# EAGLE design Arduino-DUE-SHEILD (EAGLE 8.0.0)
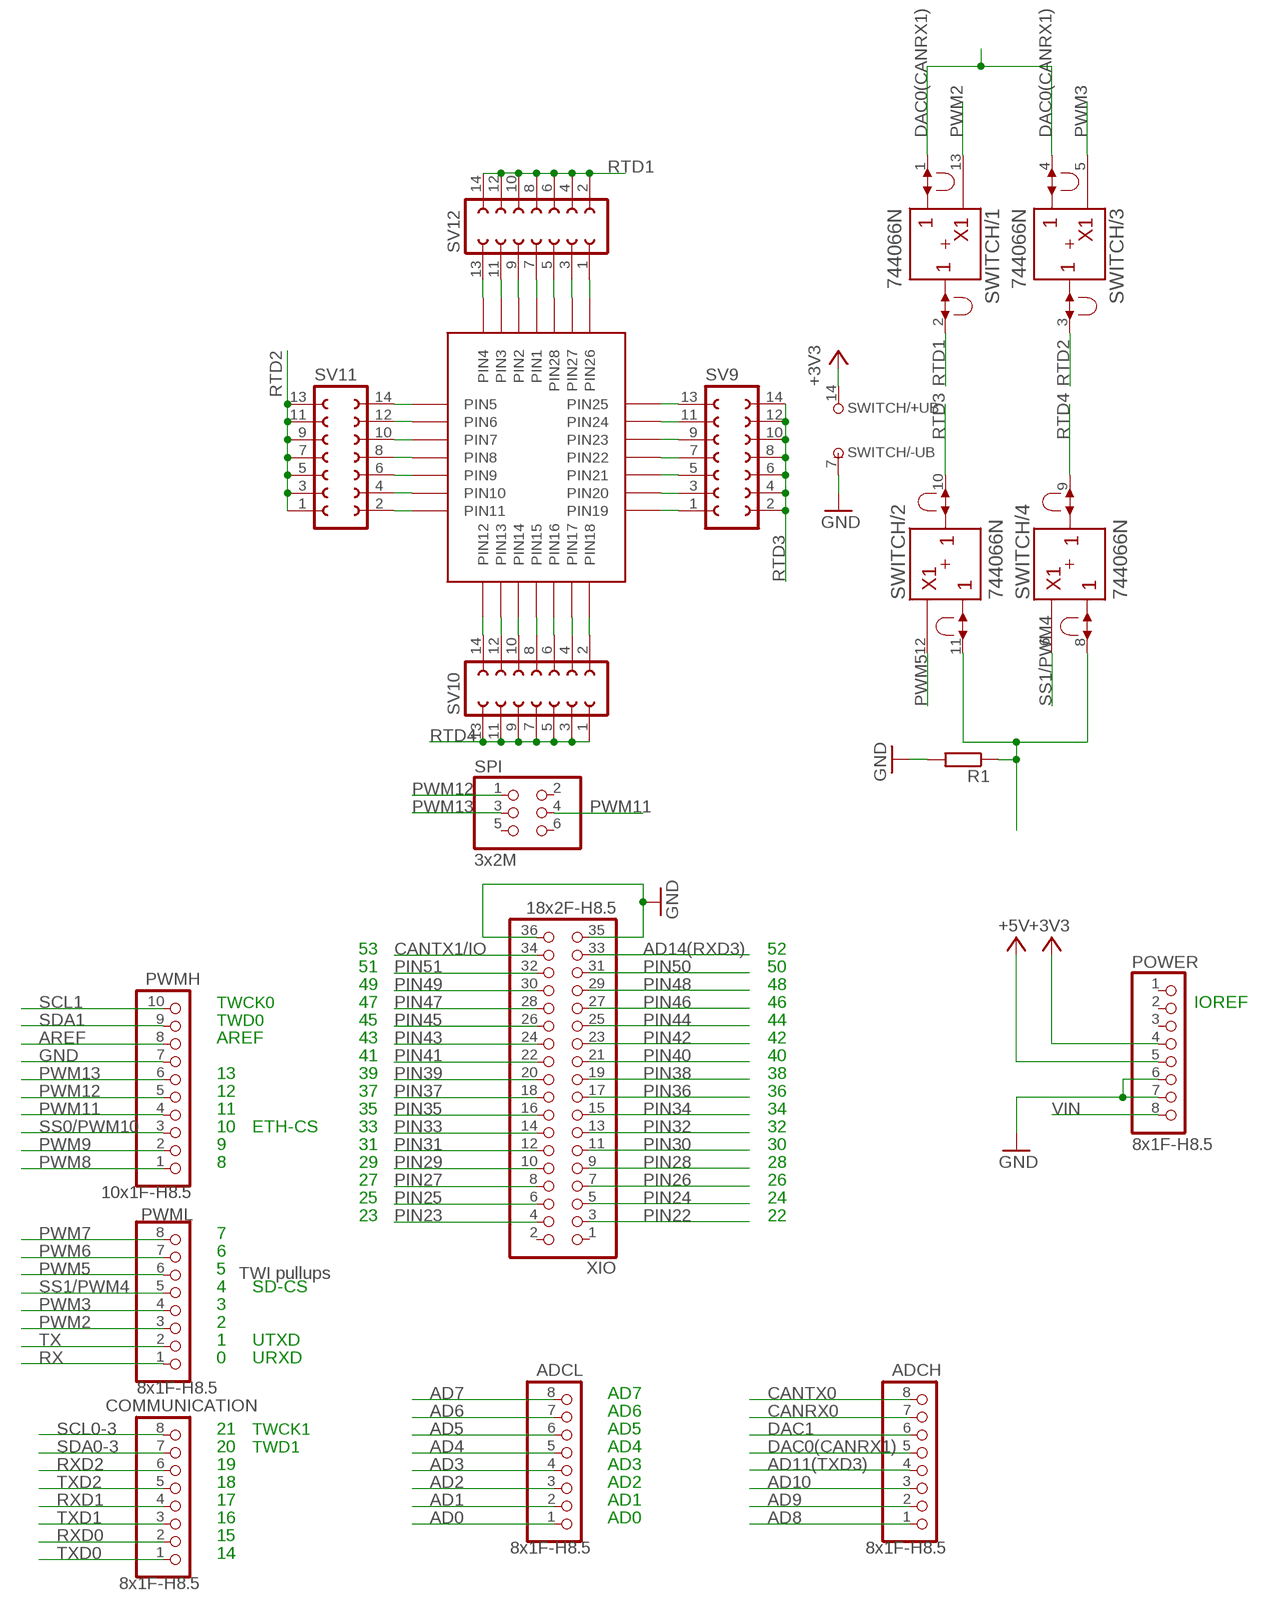
[diagram p0: schematic, sheet 1]

## Parts
ADCH  8x1F-H8.5  PINHD-1X8  [1X08]
ADCL  8x1F-H8.5  PINHD-1X8  [1X08]
COMMUNICATION  8x1F-H8.5  PINHD-1X8  [1X08]
POWER  8x1F-H8.5  PINHD-1X8  [1X08]
PWMH  10x1F-H8.5  PINHD-1X10  [1X10]
PWML  8x1F-H8.5  PINHD-1X8  [1X08]
R1  R-EU_0207/7  [0207/7]
SPI  3x2M  PINHD-2X3  [2X03]
SV9  FE07-2  [FE07-2]
SV10  FE07-2  [FE07-2]
SV11  FE07-2  [FE07-2]
SV12  FE07-2  [FE07-2]
SWITCH  744066N  [DIL14]
U$1  S28  [S28]
XIO  18x2F-H8.5  PINHD-2X18  [2X18]

## Nets
+3V3: POWER.4 SWITCH.14(/+UB:+UB)
+5V: POWER.5
AD0: ADCL.1
AD1: ADCL.2
AD2: ADCL.3
AD3: ADCL.4
AD4: ADCL.5
AD5: ADCL.6 R1.1 SWITCH.8(/4:A) SWITCH.11(/2:A)
AD6: ADCL.7
AD7: ADCL.8
AD8: ADCH.1
AD9: ADCH.2
AD10: ADCH.3
AD11(TXD3): ADCH.4
AD14(RXD3): XIO.33
AREF: PWMH.8
CANRX0: ADCH.7
CANTX0: ADCH.8
CANTX1/IO: XIO.34
DAC0(CANRX1): ADCH.5 SWITCH.1(/1:A) SWITCH.4(/3:A)
DAC1: ADCH.6
GND: POWER.6 POWER.7 PWMH.7 R1.2 SWITCH.7(/-UB:-UB) XIO.35 XIO.36
N$1: SV12.13 U$1.4(PIN4)
N$2: SV12.11 U$1.3(PIN3)
N$3: SV12.9 U$1.2(PIN2)
N$4: SV12.7 U$1.1(PIN1)
N$5: SV12.3 U$1.27(PIN27)
N$6: SV12.5 U$1.28(PIN28)
N$7: SV12.1 U$1.26(PIN26)
N$9: SV9.13 U$1.25(PIN25)
N$10: SV9.11 U$1.24(PIN24)
N$11: SV9.9 U$1.23(PIN23)
N$12: SV9.7 U$1.22(PIN22)
N$13: SV9.5 U$1.21(PIN21)
N$14: SV9.3 U$1.20(PIN20)
N$15: SV9.1 U$1.19(PIN19)
N$17: SV11.14 U$1.5(PIN5)
N$18: SV11.12 U$1.6(PIN6)
N$19: SV11.10 U$1.7(PIN7)
N$20: SV11.8 U$1.8(PIN8)
N$21: SV11.6 U$1.9(PIN9)
N$22: SV11.4 U$1.10(PIN10)
N$23: SV11.2 U$1.11(PIN11)
N$25: SV10.14 U$1.12(PIN12)
N$26: SV10.12 U$1.13(PIN13)
N$27: SV10.10 U$1.14(PIN14)
N$28: SV10.8 U$1.15(PIN15)
N$29: SV10.6 U$1.16(PIN16)
N$30: SV10.4 U$1.17(PIN17)
N$31: SV10.2 U$1.18(PIN18)
PIN22: XIO.3
PIN23: XIO.4
PIN24: XIO.5
PIN25: XIO.6
PIN26: XIO.7
PIN27: XIO.8
PIN28: XIO.9
PIN29: XIO.10
PIN30: XIO.11
PIN31: XIO.12
PIN32: XIO.13
PIN33: XIO.14
PIN34: XIO.15
PIN35: XIO.16
PIN36: XIO.17
PIN37: XIO.18
PIN38: XIO.19
PIN39: XIO.20
PIN40: XIO.21
PIN41: XIO.22
PIN42: XIO.23
PIN43: XIO.24
PIN44: XIO.25
PIN45: XIO.26
PIN46: XIO.27
PIN47: XIO.28
PIN48: XIO.29
PIN49: XIO.30
PIN50: XIO.31
PIN51: XIO.32
PWM2: PWML.3 SWITCH.13(/1:C)
PWM3: PWML.4 SWITCH.5(/3:C)
PWM5: PWML.6 SWITCH.12(/2:C)
PWM6: PWML.7
PWM7: PWML.8
PWM8: PWMH.1
PWM9: PWMH.2
PWM11: PWMH.4 SPI.4
PWM12: PWMH.5 SPI.1
PWM13: PWMH.6 SPI.3
RTD1: SV12.2 SV12.4 SV12.6 SV12.8 SV12.10 SV12.12 SV12.14 SWITCH.2(/1:B)
RTD2: SV11.1 SV11.3 SV11.5 SV11.7 SV11.9 SV11.11 SV11.13 SWITCH.3(/3:B)
RTD3: SV9.2 SV9.4 SV9.6 SV9.8 SV9.10 SV9.12 SV9.14 SWITCH.10(/2:B)
RTD4: SV10.1 SV10.3 SV10.5 SV10.7 SV10.9 SV10.11 SV10.13 SWITCH.9(/4:B)
RX: PWML.1
RXD0: COMMUNICATION.2
RXD1: COMMUNICATION.4
RXD2: COMMUNICATION.6
SCL0-3: COMMUNICATION.8
SCL1: PWMH.10
SDA0-3: COMMUNICATION.7
SDA1: PWMH.9
SS0/PWM10: PWMH.3
SS1/PWM4: PWML.5 SWITCH.6(/4:C)
TX: PWML.2
TXD0: COMMUNICATION.1
TXD1: COMMUNICATION.3
TXD2: COMMUNICATION.5
VIN: POWER.8
Unconnected: POWER.1 POWER.2 POWER.3 SPI.2 SPI.5 SPI.6 XIO.1 XIO.2

## Notes on the sheet
- 53 | 52
- 51 | 50
- 49 | 48
- TWCK0 | 47 | 46 | IOREF
- TWD0 | 45 | 44
- AREF | 43 | 42
- 41 | 40
- 13 | 39 | 38
- 12 | 37 | 36
- 11 | 35 | 34
- 10 | ETH-CS | 33 | 32
- 9 | 31 | 30
- 8 | 29 | 28
- 27 | 26
- 25 | 24
- 23 | 22
- 7
- 6
- 5 | TWI pullups
- 4 | SD-CS
- 3
- 2
- 1 | UTXD
- 0 | URXD
- AD7
- AD6
- 21 | TWCK1 | AD5
- 20 | TWD1 | AD4
- 19 | AD3
- 18 | AD2
- 17 | AD1
- 16 | AD0
- 15
- 14

## Library data of the parts
ADCH ADCL COMMUNICATION POWER PWML = SmartPrj:PINHD-1X8: PIN HEADER
PWMH = SmartPrj:PINHD-1X10: PIN HEADER
R1 = rcl:R-EU_: RESISTOR, European symbol
SPI = SmartPrj:PINHD-2X3: PIN HEADER
SV9-SV12 = con-lsta:FE07-2: FEMALE HEADER; OC_FARNELL: unknown; OC_NEWARK: unknown
SWITCH = 74ttl-din:74*4066: Quad analog SWITCH
U$1 = plcc-socket:S28
XIO = SmartPrj:PINHD-2X18: PIN HEADER

## Net classes
0 default: width 0.203 mm, drill 0.406 mm, clearance 0.203 mm
1 USB: width 0.203 mm, drill 0.406 mm, clearance 0.203 mm
2 gnd: width 0.203 mm, drill 0.406 mm, clearance 0.203 mm
3 usbvcc: width 0.203 mm, drill 0.406 mm, clearance 0.203 mm
4 USBpair: width 0.254 mm, drill 0.406 mm, clearance 0.61 mm

## Board
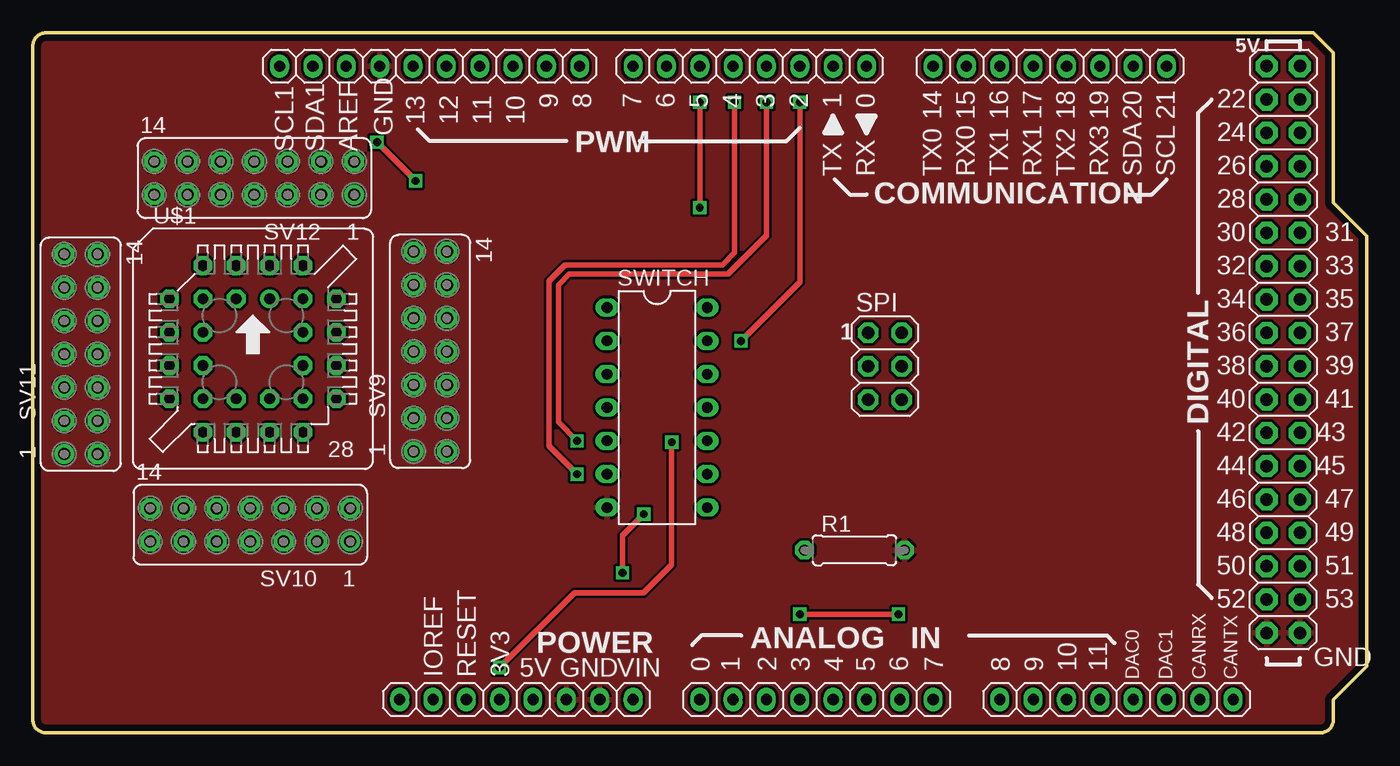
[diagram p1: board, top side]
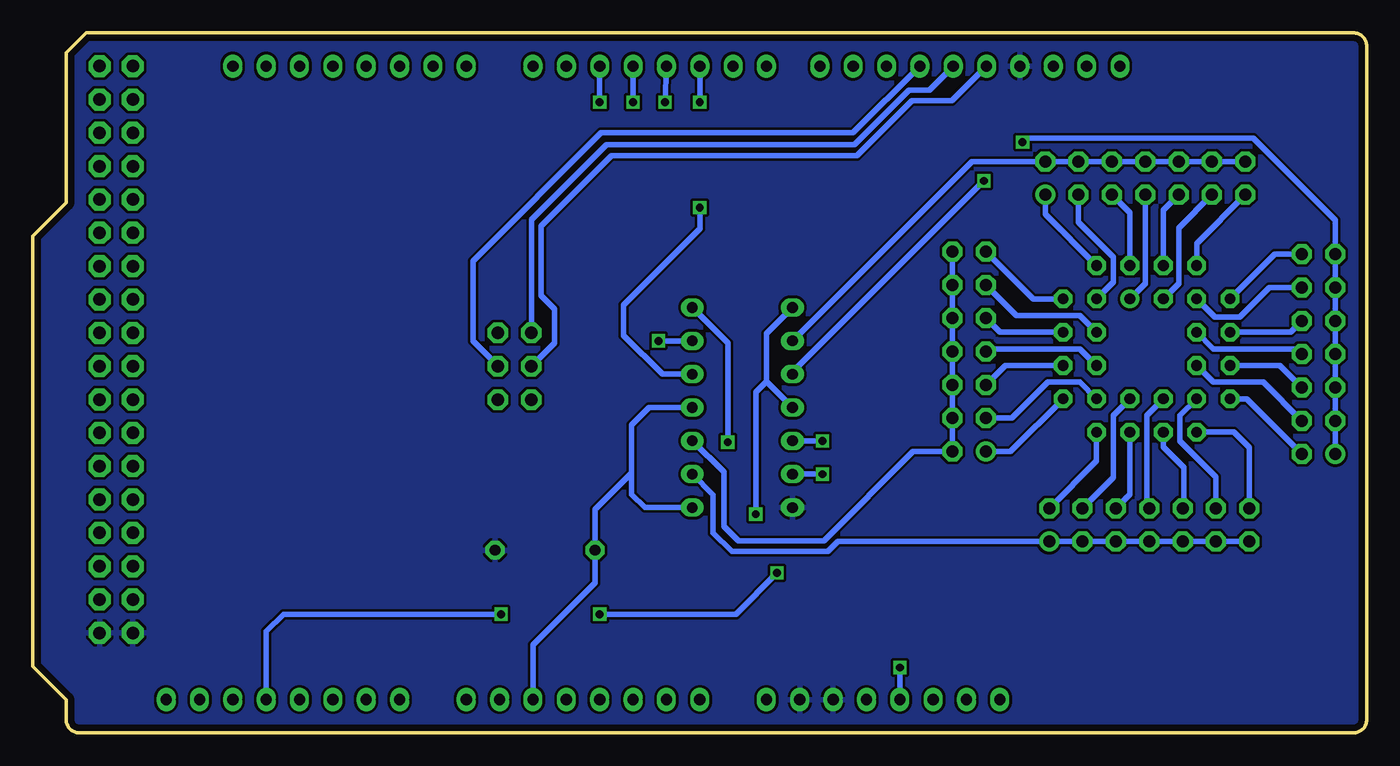
[diagram p2: board, bottom side, seen from below]

Size 101.6 x 53.34 mm. Coordinates in mm from the lower left corner, seen from the top.
Outline: 97.54,53.34 99.06,51.82 99.06,40.39 101.6,37.85 101.6,5.08 99.06,2.54 99.06,1 arc-90 98.06,0 1,0 arc-90 0,1 0,52.34 arc-90 1,53.34 97.54,53.34
Copper layers (1*16): Top 0.035mm / dielectric 1.6mm / Bottom 0.035mm
Design rules "default *": minimum track width 8mil, minimum drill 16mil, track to track 8mil, track to pad 8mil, pad to pad 8mil, via to via 8mil, smd to smd 6mil, copper to edge 20mil, drill to drill 12mil, minimum pad ring 12mil, minimum via ring 8mil, stop-mask expansion 2mil, vias tented up to drill 25mil, thermal gap 8mil

### Footprints (pad centres in the part's own frame; a part is rotated, then mirrored left to right if it is on the bottom)
1X08 = drill 0.85 pad 1.422 long: 1 -8.89,0; 2 -6.35,0; 3 -3.81,0; 4 -1.27,0; 5 1.27,0; 6 3.81,0; 7 6.35,0; 8 8.89,0
1X10 = drill 0.85 pad 1.422 long: 1 -11.43,0; 2 -8.89,0; 3 -6.35,0; 4 -3.81,0; 5 -1.27,0; 6 1.27,0; 7 3.81,0; 8 6.35,0; 9 8.89,0; 10 11.43,0
0207/7 = drill 0.813 octagon: 1 -3.81,0; 2 3.81,0
2X03 = drill 0.95 pad 1.55 octagon: 1 -2.54,-1.27; 2 -2.54,1.27; 3 0,-1.27; 4 0,1.27; 5 2.54,-1.27; 6 2.54,1.27
FE07-2 = drill 0.914: 1 -7.62,1.27 | drill 0.914 octagon: 2 -7.62,-1.27; 3 -5.08,1.27; 4 -5.08,-1.27; 5 -2.54,1.27; 6 -2.54,-1.27; 7 0,1.27; 8 0,-1.27; 9 2.54,1.27; 10 2.54,-1.27; 11 5.08,1.27; 12 5.08,-1.27; 13 7.62,1.27; 14 7.62,-1.27
DIL14 = drill 0.813 long: 1 -7.62,-3.81; 2 -5.08,-3.81; 3 -2.54,-3.81; 4 0,-3.81; 5 2.54,-3.81; 6 5.08,-3.81; 7 7.62,-3.81; 8 7.62,3.81; 9 5.08,3.81; 10 2.54,3.81; 11 0,3.81; 12 -2.54,3.81; 13 -5.08,3.81; 14 -7.62,3.81
S28 = drill 0.813: 1 1.27,3.81 | drill 0.813 octagon: 2 -1.27,6.35; 3 -1.27,3.81; 4 -3.81,6.35; 5 -6.35,3.81; 6 -3.81,3.81; 7 -6.35,1.27; 8 -3.81,1.27; 9 -6.35,-1.27; 10 -3.81,-1.27; 11 -6.35,-3.81; 12 -3.81,-6.35; 13 -3.81,-3.81; 14 -1.27,-6.35; 15 -1.27,-3.81; 16 1.27,-6.35; 17 1.27,-3.81; 18 3.81,-6.35; 19 6.35,-3.81; 20 3.81,-3.81; 21 6.35,-1.27; 22 3.81,-1.27; 23 6.35,1.27; 24 3.81,1.27; 25 6.35,3.81; 26 3.81,6.35; 27 3.81,3.81; 28 1.27,6.35
2X18 = drill 0.95 pad 1.676 octagon: 1 -21.59,-1.27; 2 -21.59,1.27; 3 -19.05,-1.27; 4 -19.05,1.27; 5 -16.51,-1.27; 6 -16.51,1.27; 7 -13.97,-1.27; 8 -13.97,1.27; 9 -11.43,-1.27; 10 -11.43,1.27; 11 -8.89,-1.27; 12 -8.89,1.27; 13 -6.35,-1.27; 14 -6.35,1.27; 15 -3.81,-1.27; 16 -3.81,1.27; 17 -1.27,-1.27; 18 -1.27,1.27; 19 1.27,-1.27; 20 1.27,1.27; 21 3.81,-1.27; 22 3.81,1.27; 23 6.35,-1.27; 24 6.35,1.27; 25 8.89,-1.27; 26 8.89,1.27; 27 11.43,-1.27; 28 11.43,1.27; 29 13.97,-1.27; 30 13.97,1.27; 31 16.51,-1.27; 32 16.51,1.27; 33 19.05,-1.27; 34 19.05,1.27; 35 21.59,-1.27; 36 21.59,1.27

### Placement (x,y rotation side)
ADCH  82.55,2.54 0 top
ADCL  59.69,2.54 0 top
COMMUNICATION  77.47,50.8 0 top
POWER  36.83,2.54 0 top
PWMH  30.23,50.8 180 top
PWML  54.61,50.8 180 top
R1  62.59,13.92 0 top
SPI  64.9,27.94 270 top
SV9  30.28,29.06 90 top
SV10  16.56,15.85 180 top
SV11  3.66,28.85 90 top
SV12  16.87,42.27 180 top
SWITCH  47.55,24.79 270 top
U$1  16.76,29.26 0 top
XIO  95.25,29.21 270 top

### Tracks (layer width: path | path; a pad name or v marks a point on that pad's centre or on a via)
+3V3  (via drill 0.6)
  Top 0.406: v48.67,22.15 48.67,12.8 46.53,10.67 41.25,10.67 v35.56,4.98
  Bottom 0.406: SWITCH.14 48.67,29.72 v48.67,22.15 | v35.56,4.98 POWER.4
AD5
  Bottom 0.406: SWITCH.11 54.66,24.79 55.98,23.47 55.98,19.81 | 55.98,19.81 55.98,18.19 54.97,17.17 SWITCH.8 | 55.98,19.81 58.78,17.02 R1.1 58.78,11.43 63.5,6.71 ADCL.6
DAC0(CANRX1)  (via drill 0.6)
  Top 0.406: v46.53,16.66 44.91,15.04 v44.91,12.19 | v58.42,9.04 v65.94,9.04
  Bottom 0.406: SWITCH.1 45.72,30.43 45.72,26.77 | SWITCH.4 45.72,26.77 | 45.72,26.77 46.53,25.96 v46.53,16.66 | v44.91,12.19 48.06,9.04 v58.42,9.04 | ADCH.5 83.82,7.72 82.5,9.04 v65.94,9.04
GND
  pour Top: -1.42,54.46 103.73,54.46 103.73,-2.95 -1.42,-2.95
  pour Bottom: -2.13,54.36 104.04,54.36 104.04,-2.54 -2.13,-2.54
N$1
  Bottom 0.406: U$1.4 12.95,37.29 SV12.13
N$2
  Bottom 0.406: U$1.3 14.33,34.24 14.33,38.46 SV12.11
N$3
  Bottom 0.406: U$1.2 15.49,39.83 SV12.9
N$4
  Bottom 0.406: U$1.1 16.87,34.24 SV12.7
N$5
  Bottom 0.406: U$1.27 19.3,34.34 19.3,36.27 21.95,38.91 SV12.3
N$6
  Bottom 0.406: U$1.28 18.03,39.62 SV12.5
N$7
  Bottom 0.406: U$1.26 24.49,39.52 SV12.1
N$9
  Bottom 0.406: U$1.25 25.4,33.07 SV9.13
N$10
  Bottom 0.406: U$1.24 21.84,31.8 26.67,31.8 SV9.11
N$11
  Bottom 0.406: U$1.23 27.94,30.53 SV9.9
N$12
  Bottom 0.406: U$1.22 21.84,29.26 28.8,29.26 SV9.7
N$13
  Bottom 0.406: U$1.21 27.53,27.99 SV9.5
N$14
  Bottom 0.406: U$1.20 21.84,26.72 24.28,26.72 27.03,23.98 SV9.3
N$15
  Bottom 0.406: U$1.19 27.13,21.44 SV9.1
N$17
  Bottom 0.406: U$1.5 7.01,36.47 SV11.14
N$18
  Bottom 0.406: U$1.6 11.58,31.7 9.65,31.7 7.42,33.93 SV11.12
N$19
  Bottom 0.406: U$1.7 5.79,30.53 SV11.10
N$20
  Bottom 0.406: U$1.8 11.68,29.26 5.33,29.26 SV11.8
N$21
  Bottom 0.406: U$1.9 6.6,27.99 SV11.6
N$22
  Bottom 0.406: U$1.10 11.68,26.72 7.87,26.72 SV11.4
N$23
  Bottom 0.406: U$1.11 9.14,25.45 SV11.2
N$25
  Bottom 0.406: U$1.12 10.11,22.91 8.94,21.74 SV10.14
N$26
  Bottom 0.406: U$1.13 14.22,24.18 14.22,22.25 11.48,19.51 SV10.12
N$27
  Bottom 0.406: U$1.14 15.49,21.79 13.92,20.22 13.92,17.22 SV10.10
N$28
  Bottom 0.406: U$1.15 16.76,24.18 16.76,17.32 SV10.8
N$29
  Bottom 0.406: U$1.16 18.03,18.19 SV10.6
N$30
  Bottom 0.406: U$1.17 19.3,24.18 19.3,19.46 SV10.4
N$31
  Bottom 0.406: U$1.18 20.57,20.73 SV10.2
PWM2  (via drill 0.6)
  Top 0.406: v53.95,29.87 58.42,34.34 v58.42,48.06
  Bottom 0.406: SWITCH.13 v53.95,29.87 | v58.42,48.06 PWML.3
PWM3  (via drill 0.6)
  Top 0.406: v41.45,22.25 40.03,23.67 40.03,34.14 40.84,34.95 52.93,34.95 55.88,37.9 v55.88,48.06
  Bottom 0.406: SWITCH.5 v41.45,22.25 | v55.88,48.06 PWML.4
PWM5  (via drill 0.6)
  Top 0.406: v50.8,40.03 v50.8,48.06
  Bottom 0.406: SWITCH.12 53.65,27.33 56.59,30.28 56.59,32.61 50.8,38.41 v50.8,40.03 | v50.8,48.06 PWML.6
PWM11
  Bottom 0.406: PWMH.4 39.12,45.72 58.32,45.72 68.07,35.97 68.07,29.84 SPI.4
PWM12
  Bottom 0.406: SPI.1 63.63,39.09 57.91,44.81 39.01,44.81 34.85,48.97 33.33,48.97 PWMH.5
PWM13
  Bottom 0.406: SPI.3 61.87,29.69 61.87,32.31 62.89,33.33 62.89,38.61 57.51,43.99 38.81,43.99 34.65,48.16 31.6,48.16 PWMH.6
RTD1
  Bottom 0.406: SV12.14 SV12.12 SV12.10 SV12.8 SV12.6 SV12.4 SV12.2 30.07,43.54 SWITCH.2
RTD2  (via drill 0.6)
  Top 0.406: v26.21,45.01 v29.16,42.06
  Bottom 0.406: SV11.1 SV11.3 SV11.5 SV11.7 SV11.9 SV11.11 SV11.13 2.39,39.06 8.64,45.31 25.91,45.31 v26.21,45.01 | v29.16,42.06 43.74,27.48 SWITCH.3
RTD3
  Bottom 0.406: SV9.14 SV9.12 SV9.10 SV9.8 SV9.6 SV9.4 SV9.2 34.54,21.44 41.35,14.63 47.85,14.63 48.97,15.75 48.97,19.86 SWITCH.10
RTD4
  Bottom 0.406: SV10.13 SV10.11 SV10.9 SV10.7 SV10.5 SV10.3 SV10.1 40.28,14.58 41.05,13.82 48.36,13.82 49.78,15.24 49.78,18.14 SWITCH.9
SS1/PWM4  (via drill 0.6)
  Top 0.406: v41.45,19.71 39.32,21.84 39.32,34.44 40.54,35.66 52.53,35.66 53.44,36.58 v53.44,48.06
  Bottom 0.406: SWITCH.6 v41.45,19.71 | v53.44,48.06 PWML.5

### Text on the board
tPlace: 9 | 8 | 7 | 6 | 5 | 4 | 3 | 2 | 1 | 0 | 22 | 14 | 15 | 16 | 17 | 18 | 19 | 20 | 21 | 13 | 12 | 11 | 10 | 24 | 26 | 28 | 30 | 31 | 32 | 33 | 34 | 35 | 36 | 37 | 38 | 39 | 40 | 41 | 42 | 43 | 44 | 45 | 46 | 47 | 48 | 49 | 50 | 51 | 52 | 53 | 0 | 1 | 2 | 3 | 4 | 5 | 6 | 7 | 8 | 9 | 10 | 11 | DAC0 | DAC1 | CANRX | CANTX
tNames: 5V | GND | SCL1 | SDA1 | AREF | PWM | TX | RX | TX0 | RX0 | TX1 | RX1 | TX2 | RX3 | SDA | SCL | 1 | DIGITAL | ANALOG IN | GND | IOREF | RESET | 3V3 | 5V | GND | VIN